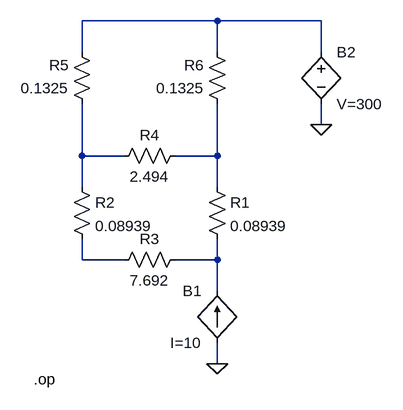
[diagram p0: schematic steady_state_crosscheck.asc]
steady_state_crosscheck.asc, the LTspice schematic file:
Version 4
SHEET 1 880 680
WIRE 112 -160 -96 -160
WIRE 272 -160 112 -160
WIRE -96 -112 -96 -160
WIRE 112 -112 112 -160
WIRE 272 -112 272 -160
WIRE 272 0 272 -32
WIRE -96 48 -96 -32
WIRE -32 48 -96 48
WIRE 112 48 112 -32
WIRE 112 48 48 48
WIRE -96 96 -96 48
WIRE 112 96 112 48
WIRE -96 208 -96 176
WIRE -32 208 -96 208
WIRE 112 208 112 176
WIRE 112 208 48 208
WIRE 112 256 112 208
WIRE 112 368 112 336
FLAG 112 368 0
FLAG 272 0 0
DATAFLAG 112 208 ""
DATAFLAG -96 208 ""
SYMBOL bi 112 336 R180
WINDOW 0 24 80 Left 2
WINDOW 3 24 0 Left 2
SYMATTR InstName B1
SYMATTR Value I=10
SYMBOL res 96 80 R0
SYMATTR InstName R1
SYMATTR Value 0.08939
SYMBOL res -112 80 R0
SYMATTR InstName R2
SYMATTR Value 0.08939
SYMBOL res 64 192 R90
WINDOW 0 0 56 VBottom 2
WINDOW 3 32 56 VTop 2
SYMATTR InstName R3
SYMATTR Value 7.692
SYMBOL res 64 32 R90
WINDOW 0 0 56 VBottom 2
WINDOW 3 32 56 VTop 2
SYMATTR InstName R4
SYMATTR Value 2.494
SYMBOL res -80 -16 R180
WINDOW 0 36 76 Left 2
WINDOW 3 36 40 Left 2
SYMATTR InstName R5
SYMATTR Value 0.1325
SYMBOL res 128 -16 R180
WINDOW 0 36 76 Left 2
WINDOW 3 36 40 Left 2
SYMATTR InstName R6
SYMATTR Value 0.1325
SYMBOL bv 272 -128 R0
SYMATTR InstName B2
SYMATTR Value V=300
TEXT -170 392 Left 2 !.op

The netlist it stands for:
* steady_state_crosscheck.asc
B1 0 N005 I=10
R1 N003 N005 0.08939
R2 N002 N004 0.08939
R3 N005 N004 7.692
R4 N003 N002 2.494
R5 N002 N001 0.1325
R6 N003 N001 0.1325
B2 N001 0 V=300
.op
.backanno
.end